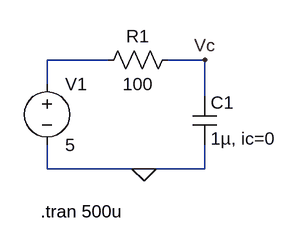
[diagram p0: schematic transientAnalysis.asc]
transientAnalysis.asc, the LTspice schematic file:
Version 4
SHEET 1 1004 680
WIRE 112 80 32 80
WIRE 240 80 192 80
WIRE 32 112 32 80
WIRE 240 128 240 80
WIRE 32 224 32 192
WIRE 160 224 32 224
WIRE 240 224 240 192
WIRE 240 224 160 224
FLAG 160 224 0
FLAG 240 80 Vc
SYMBOL res 208 64 R90
WINDOW 0 0 56 VBottom 2
WINDOW 3 32 56 VTop 2
SYMATTR InstName R1
SYMATTR Value 100
SYMBOL cap 224 128 R0
SYMATTR InstName C1
SYMATTR Value 1µ, ic=0
SYMBOL voltage 32 96 R0
SYMATTR InstName V1
SYMATTR Value 5
TEXT 24 280 Left 2 !.tran 500u

The netlist it stands for:
* transientAnalysis.asc
R1 Vc N001 100
C1 Vc 0 1µ, ic=0
V1 N001 0 5
.tran 500u
.backanno
.end